# EasyEDA schematic SCH_RE2-YMF262-REV.0.5_2024-09-21.json

## Sheets
1 OPL3: TITLE: Sheet_1; REV: 1.0; Date: 2024-01-10; Sheet: 1/1; Drawn By: Denjhang; Company: Your Company
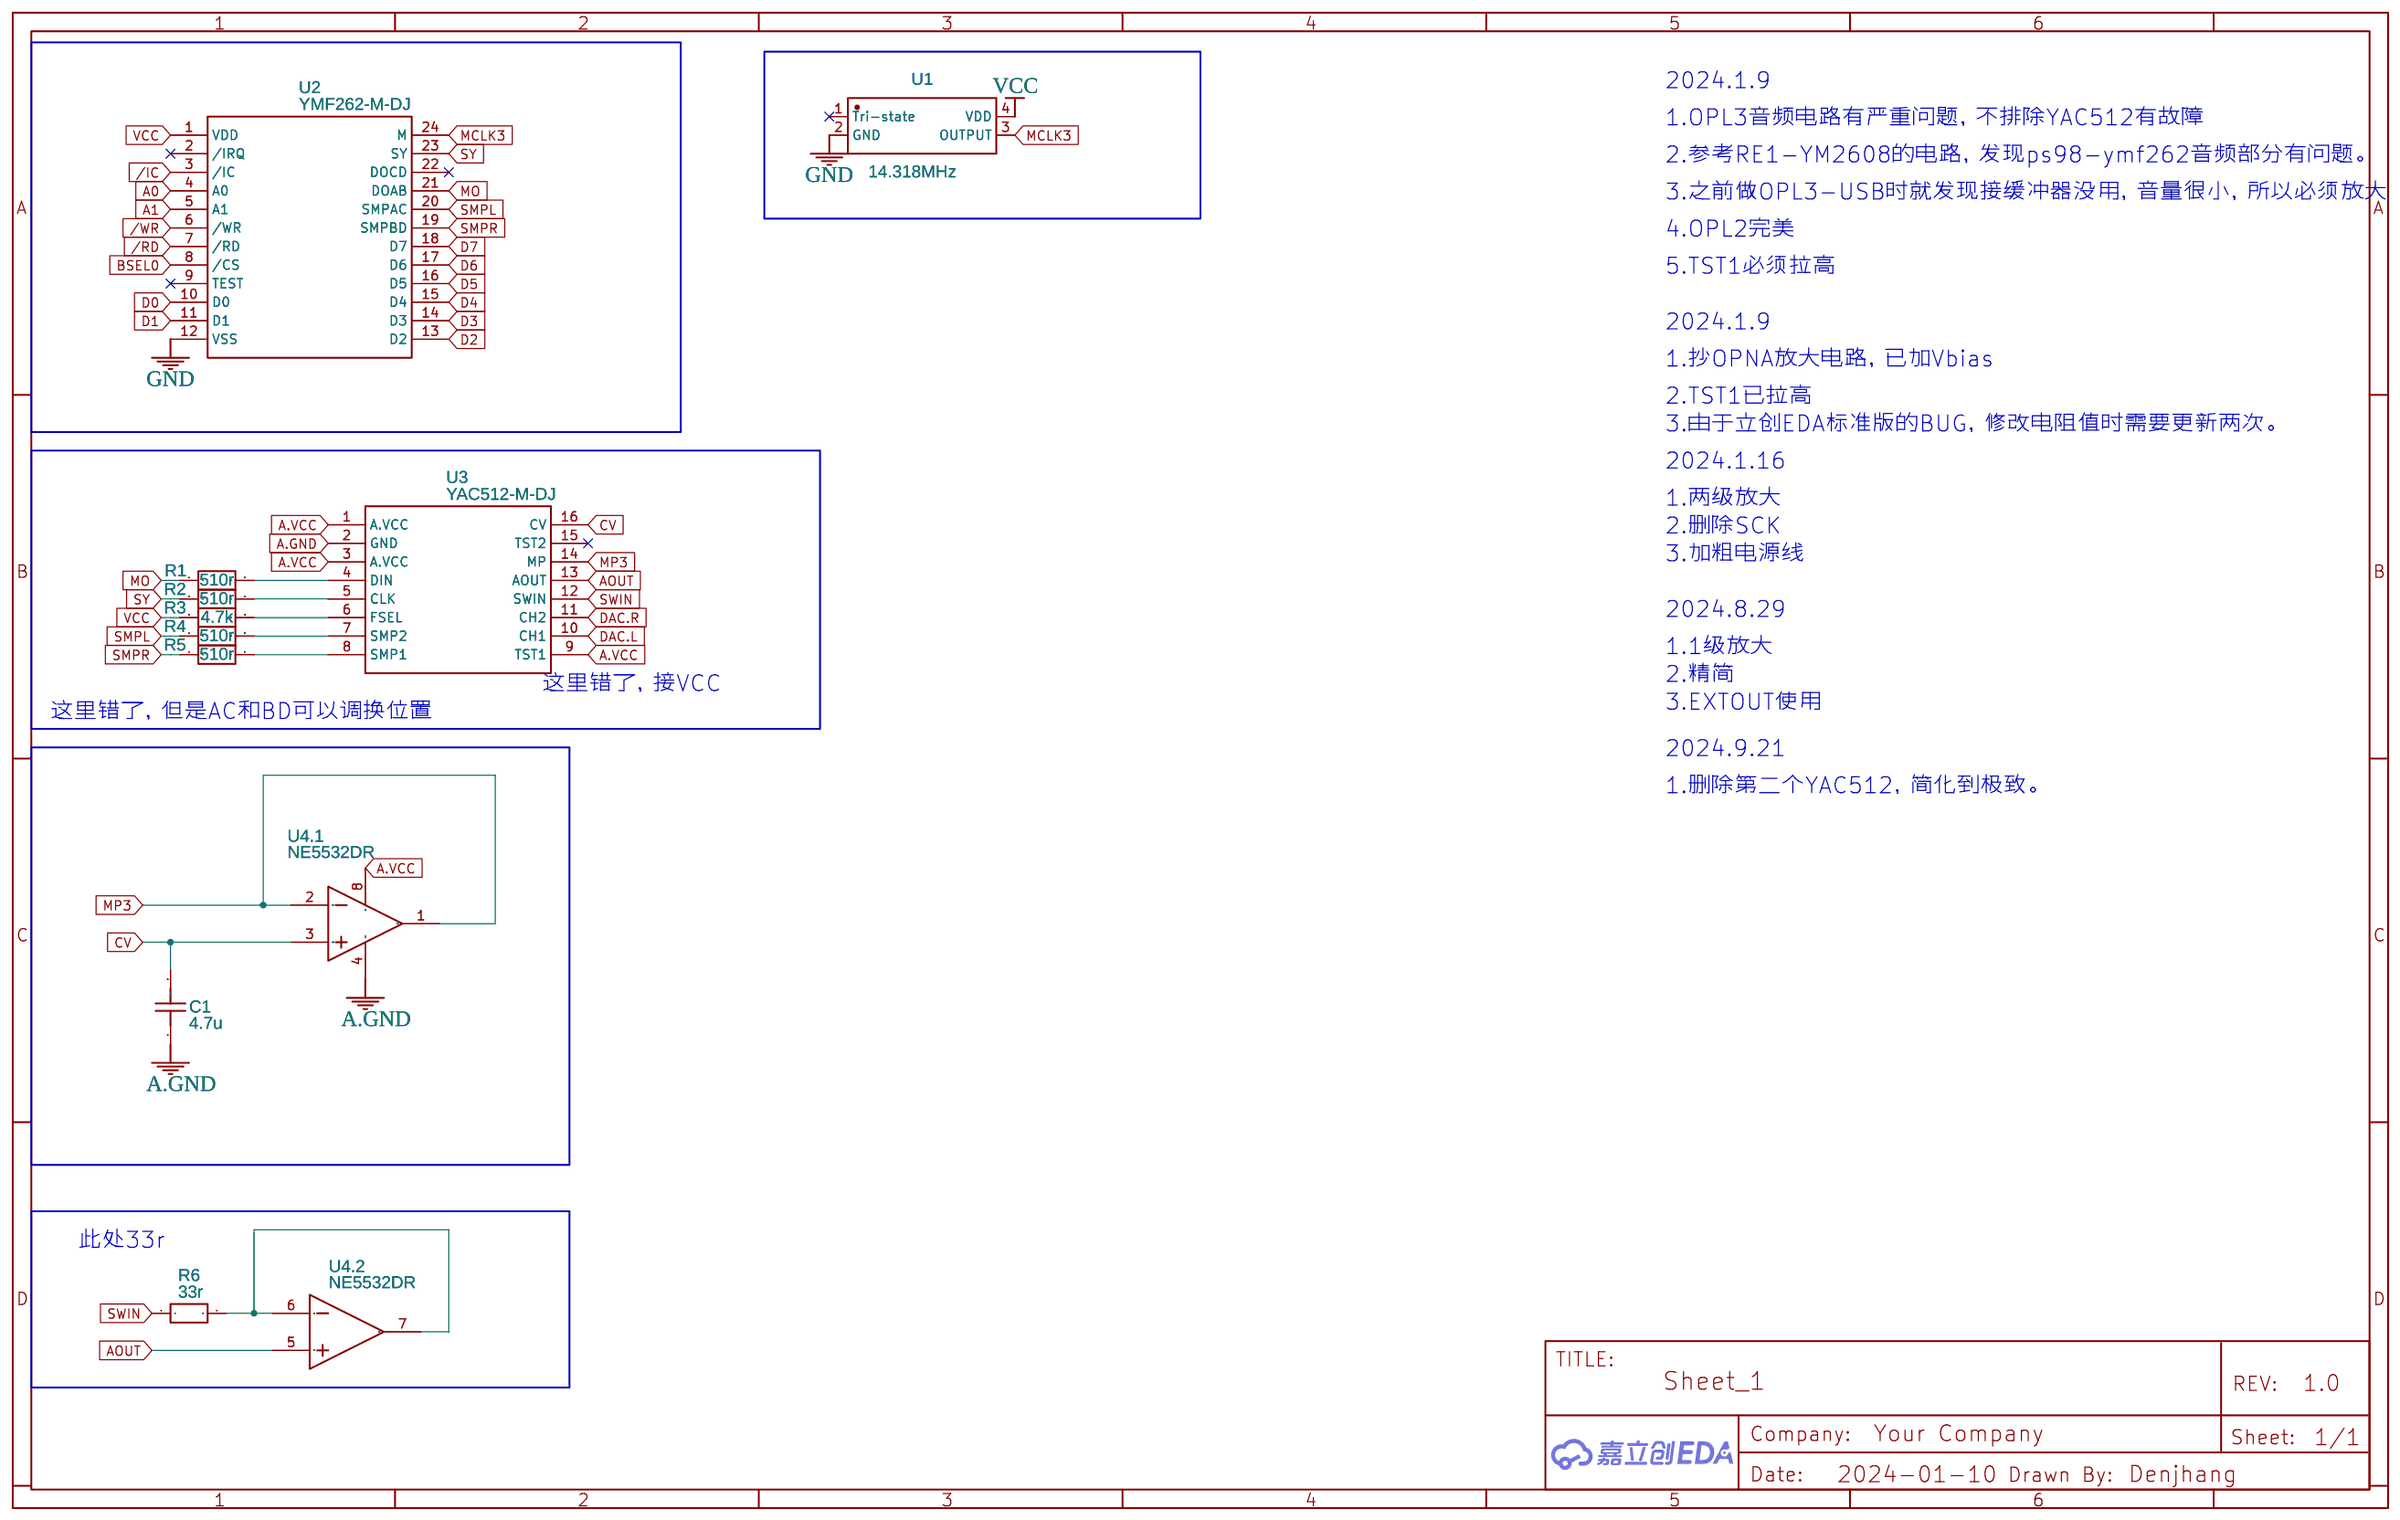
[diagram p0: OPL3]
2 BUS
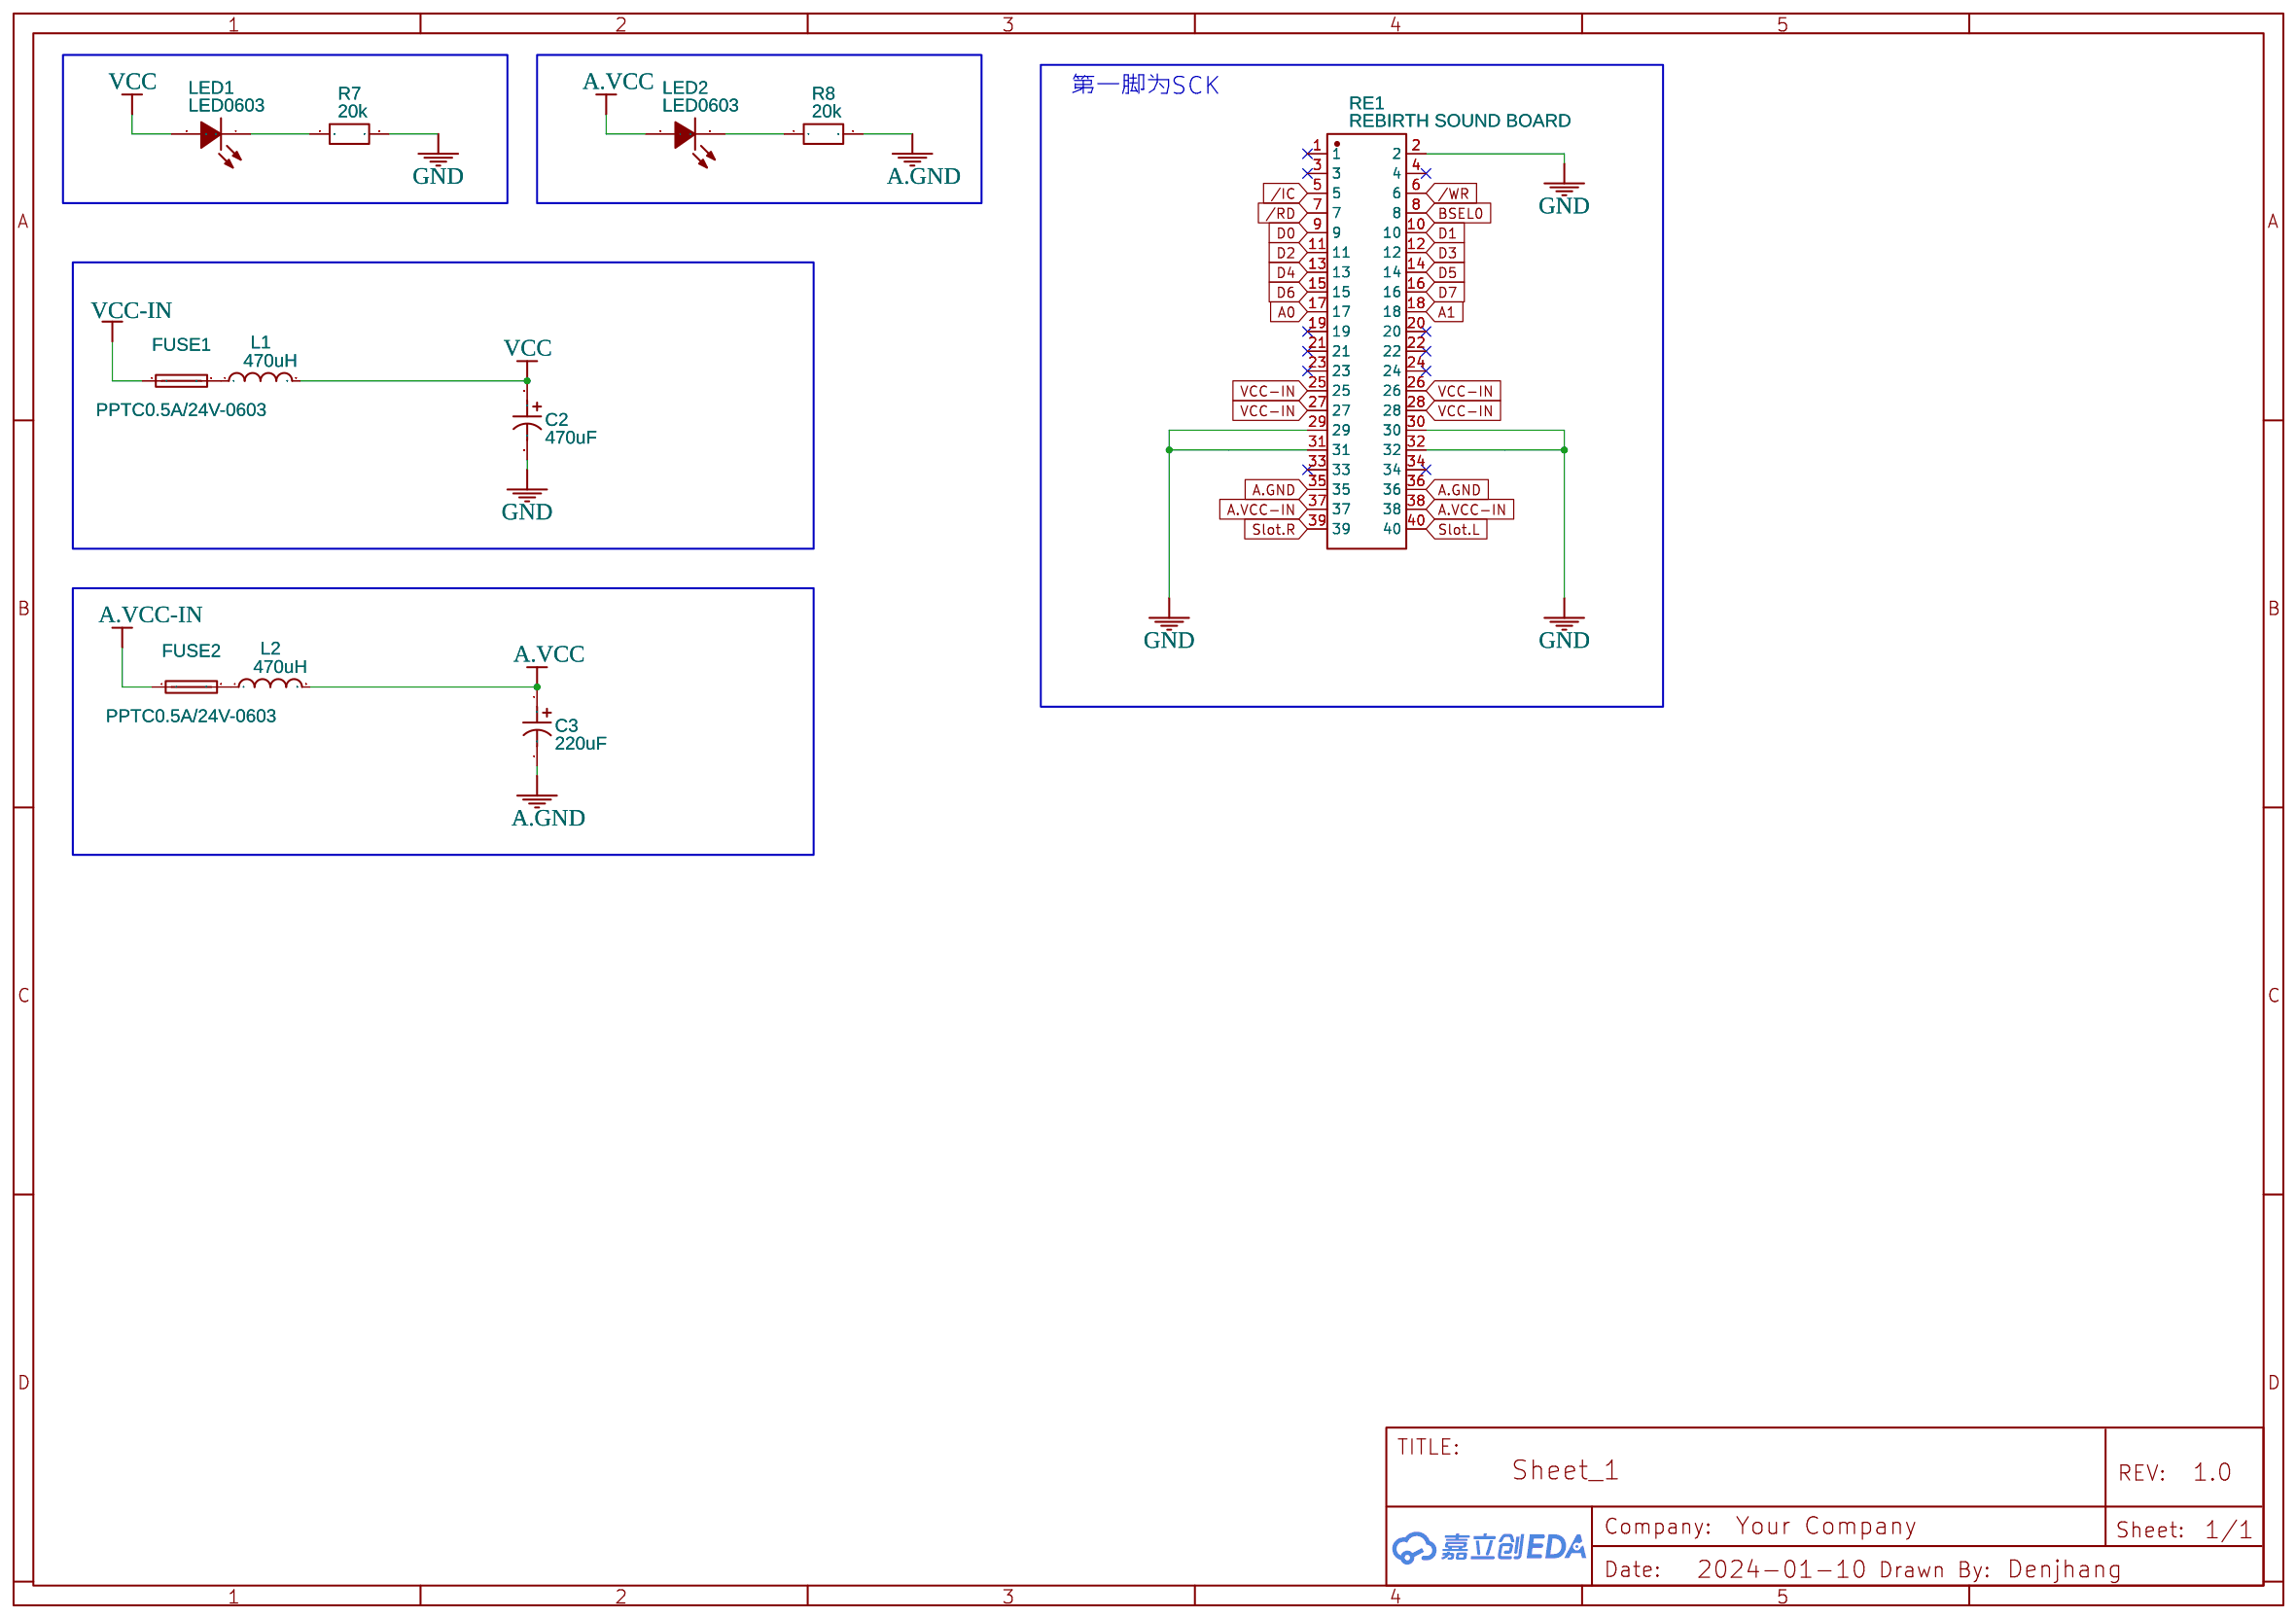
[diagram p1: BUS]
3 AMP2: Date: 2024-01-16
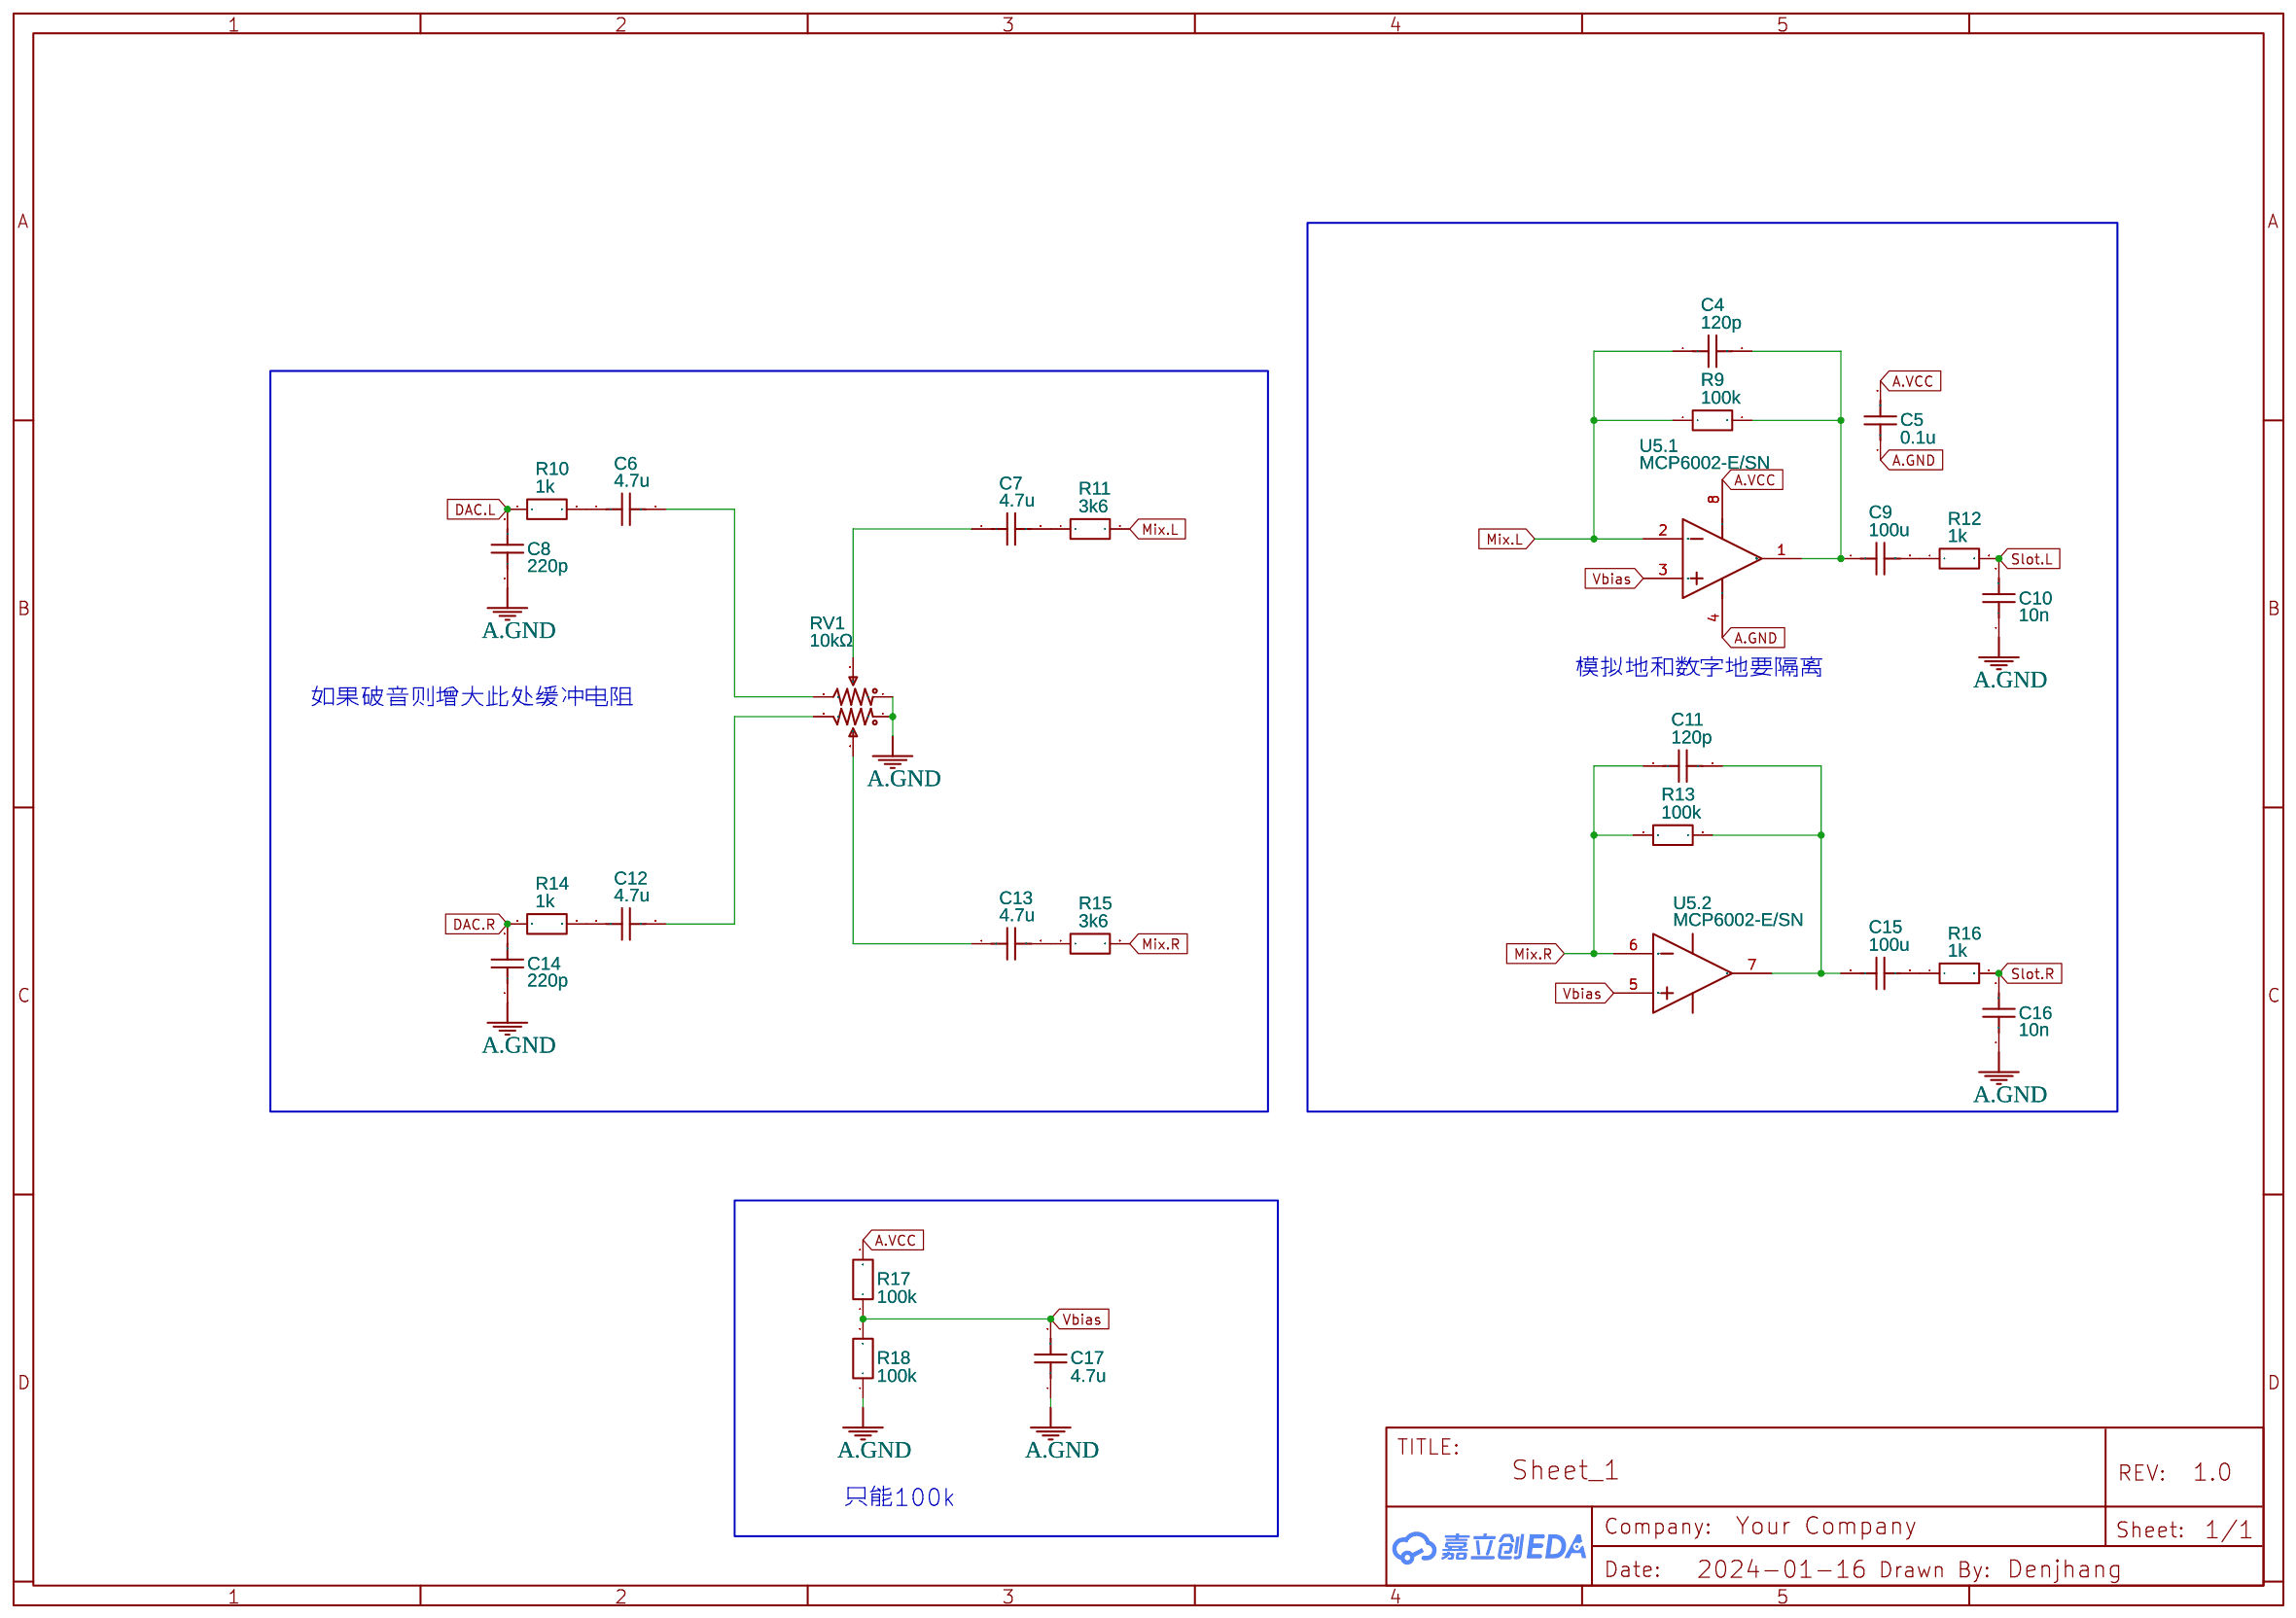
[diagram p2: AMP2]

## Parts
sheet AMP2
C4  120p  [C0603]
C5  0.1u  [C0603]
C6  4.7u  [C0603]
C7  4.7u  [C0603]
C8  220p  [C0603]
C9  100u  [C1206]
C10  10n  [C0603]
C11  120p  [C0603]
C12  4.7u  [C0603]
C13  4.7u  [C0603]
C14  220p  [C0603]
C15  100u  [C1206]
C16  10n  [C0603]
C17  4.7u  [C0603]
R9  100k  [R0603]
R10  1k  [R0603]
R11  3k6  [R0603]
R12  1k  [R0603]
R13  100k  [R0603]
R14  1k  [R0603]
R15  3k6  [R0603]
R16  1k  [R0603]
R17  100k  [R0603]
R18  100k  [R0603]
RV1  10kΩ  [RK097G-DJ]
U5  MCP6002-E/SN  [SOIC-8_L5.0-W4.0-P1.27-LS6.0-BL]  (sections 1,2)
sheet BUS
C2  470uF  [CAP-SMD_BD6.3-L6.6-W6.6-FD]
C3  220uF  [CAP-SMD_BD6.3-L6.6-W6.6-LS7.2-FD]
FUSE1  PPTC0.5A/24V-0603  [F0603]
FUSE2  PPTC0.5A/24V-0603  [F0603]
L1  470uH  [IND-SMD_L5.8-W5.2]
L2  470uH  [IND-SMD_L5.8-W5.2]
LED1  LED0603  [LED0603-RD]
LED2  LED0603  [LED0603-RD]
R7  20k  [R0603]
R8  20k  [R0603]
RE1  REBIRTH SOUND BOARD  [REBIRTH SOUND BOARD]
sheet OPL3
C1  4.7u  [C0603]
R1  510r  [R0603]
R2  510r  [R0603]
R3  4.7k  [R0603]
R4  510r  [R0603]
R5  510r  [R0603]
R6  33r  [R0603]
U1  14.318MHz  [OSC-SMD_4P-L3.2-W2.5-BL]
U2  YMF262-M-DJ  [SOIC24-YMF276]
U3  YAC512-M-DJ  [YAC512-M-DJ]
U4  NE5532DR  [SOIC-8_L4.9-W3.9-P1.27-LS6.0-BL]  (sections 1,2)

## Library data of the parts
C1 C4-C8 C10-C14 C16 C17 = C_0603_US: Contributor: LCEDA_Lib
C9 C15 = C_1206_US: Contributor: LCEDA_Lib
R1-R18 = R_0603_EU: Contributor: LCEDA_Lib
RV1 = RK097-双连体: Contributor: LCSC; Supplier: LCSC; Supplier Part: C231763; Manufacturer: ALPSALPINE(阿尔卑斯阿尔派); Manufacturer Part: RK09712200MY; JLCPCB Part Class: Extended Part
U5 = MCP6002-E/SN: subpart_no: 1; Supplier: LCSC; Supplier Part: C636235; Manufacturer: MICROCHIP(美国微芯); JLCPCB Part Class: Extended Part
C2 = RVT220UF16V67RV0015: Contributor: LCSC; Supplier: LCSC; Supplier Part: C2887273; Manufacturer: KNSCHA(科尼盛); JLCPCB Part Class: Extended Part; link: https://so.szlcsc.com/global.html?k=C2887273&ref=editor
C3 = RVT47UF35V67RV0039: Contributor: LCSC; Supplier: LCSC; Supplier Part: C2836440; Manufacturer: KNSCHA(科尼盛); JLCPCB Part Class: Extended Part; link: https://so.szlcsc.com/global.html?k=C2836440&ref=editor
FUSE1 FUSE2 = PPTC0.5A/24V-0603: Contributor: LCSC; Supplier: LCSC; Supplier Part: C9900007586; Manufacturer: null; Manufacturer Part: PPTC0.5A/24V 自恢复保险丝-0603; JLCPCB Part Class: Extended Part
L1 L2 = MSCD54-471KT: Contributor: LCSC; Supplier: LCSC; Supplier Part: C915206; Manufacturer: Meled(美莱); JLCPCB Part Class: Extended Part; link: https://so.szlcsc.com/global.html?k=C915206&ref=editor
LED1 LED2 = LED0603: Supplier: LCSC; Supplier Part: C2892154; Manufacturer: GBG; Manufacturer Part: GBG-C192KRKT; link: https://atta.szlcsc.comnull; Contributor: Denjhang
RE1 = REBIRTH SOUND BOARD: Contributor: lcsc; Supplier: LCSC; Supplier Part: C5242133; Manufacturer: XKB Connectivity(中国星坤); Manufacturer Part: X6522WR-2x20H-C60D30-E43F03
U1 = OT32254MJBA4SL: Contributor: lcsc; Supplier: LCSC; Supplier Part: C2831397; Manufacturer: YXC(扬兴晶振); JLCPCB Part Class: Extended Part; link: https://so.szlcsc.com/global.html?k=C2831397&ref=editor
U2 = YMF262-M-DJ: Contributor: denjhang
U3 = YAC512-M-DJ: Contributor: denjhang
U4 = NE5532DR: image: //image.lceda.cn/szlcsc/C7426.jpg; SMT Type: Basic; subpart_no: 2; Supplier: LCSC; Manufacturer: TI(德州仪器); LCSC Assembly: Yes; Supplier Part: C7426; JLCPCB Part Class: Basic Part

## Nets
GND: C2.2 R7.2 RE1.2 RE1.29 RE1.30 RE1.31 RE1.32 U1.2(GND) U2.12(VSS)
VCC: C2.1 L1.2 LED1.2(A) R3.1 U1.4(VDD) U2.1(VDD)
VCC-IN: FUSE1.1 RE1.25 RE1.26 RE1.27 RE1.28
/IC: RE1.5 U2.3(/IC)
/RD: RE1.7 U2.7(/RD)
/WR: RE1.6 U2.6(/WR)
A0: RE1.17 U2.4(A0)
A1: RE1.18 U2.5(A1)
A.GND: C1.1 C3.2 C5.1 C8.1 C10.1 C14.1 C16.1 C17.1 R8.2 R18.1 RE1.35 RE1.36 RV1.1 RV1.4 U3.2(GND) U4.4(VCC-/GND) U5.4(VSS)
A.VCC: C3.1 C5.2 L2.2 LED2.2(A) R17.2 U3.1(A.VCC) U3.3(A.VCC) U3.9(TST1) U4.8(VCC+) U5.8(VDD)
A.VCC-IN: FUSE2.1 RE1.37 RE1.38
AOUT: U3.13(AOUT) U4.5(IN2+)
BSEL0: RE1.8 U2.8(/CS)
CV: C1.2 U3.16(CV) U4.3(IN1+)
D0: RE1.9 U2.10(D0)
D1: RE1.10 U2.11(D1)
D2: RE1.11 U2.13(D2)
D3: RE1.12 U2.14(D3)
D4: RE1.13 U2.15(D4)
D5: RE1.14 U2.16(D5)
D6: RE1.15 U2.17(D6)
D7: RE1.16 U2.18(D7)
DAC.L: C8.2 R10.1 U3.10(CH1)
DAC.R: C14.2 R14.1 U3.11(CH2)
MCLK3: U1.3(OUTPUT) U2.24(M)
Mix.L: C4.1 R9.1 R11.2 U5.2(VINA-)
Mix.R: C11.1 R13.1 R15.2 U5.6(VINB-)
MO: R1.1 U2.21(DOAB)
MP3: U3.14(MP) U4.1(OUT1) U4.2(IN1-)
Slot.L: C10.2 R12.2 RE1.40
Slot.R: C16.2 R16.2 RE1.39
SMPL: R4.1 U2.20(SMPAC)
SMPR: R5.1 U2.19(SMPBD)
SWIN: R6.1 U3.12(SWIN)
SY: R2.1 U2.23(SY)
Vbias: C17.2 R17.1 R18.2 U5.3(VINA+) U5.5(VINB+)
Net-(C4-2): C4.2 C9.1 R9.2 U5.1(VOUTA)
Net-(C6-1): C6.1 R10.2
Net-(C6-2): C6.2 RV1.3
Net-(C7-1): C7.1 RV1.2
Net-(C7-2): C7.2 R11.1
Net-(C9-2): C9.2 R12.1
Net-(C11-2): C11.2 C15.1 R13.2 U5.7(VOUTB)
Net-(C12-1): C12.1 R14.2
Net-(C12-2): C12.2 RV1.6
Net-(C13-1): C13.1 RV1.5
Net-(C13-2): C13.2 R15.1
Net-(C15-2): C15.2 R16.1
Net-(FUSE1-2): FUSE1.2 L1.1
Net-(FUSE2-2): FUSE2.2 L2.1
Net-(LED1-1): LED1.1(C) R7.1
Net-(LED2-1): LED2.1(C) R8.1
Net-(R1-2): R1.2 U3.4(DIN)
Net-(R2-2): R2.2 U3.5(CLK)
Net-(R3-2): R3.2 U3.6(FSEL)
Net-(R4-2): R4.2 U3.7(SMP2)
Net-(R5-2): R5.2 U3.8(SMP1)
Net-(R6-2): R6.2 U4.6(IN2-) U4.7(OUT2)

Not connected (* = marked no-connect by the designer): RE1 1* 3* 4* 19* 20* 21* 22* 23* 24* 33* 34*; U1 1(Tri-state)*; U2 2(/IRQ)* 9(TEST)* 22(DOCD)*; U3 15(TST2)*

## Notes on the sheets
sheet 1
- 2024.1.9
- 1.OPL3音频电路有严重问题，不排除YAC512有故障
- 2.参考RE1-YM2608的电路，发现ps98-ymf262音频部分有问题。
- 3.之前做OPL3-USB时就发现接缓冲器没用，音量很小，所以必须放大
- 4.OPL2完美
- 5.TST1必须拉高
- 2024.1.9
- 1.抄OPNA放大电路，已加Vbias
- 2.TST1已拉高
- 3.由于立创EDA标准版的BUG，修改电阻值时需要更新两次。
- 2024.1.16
- 1.两级放大
- 2.删除SCK
- 3.加粗电源线
- 2024.8.29
- 1.1级放大
- 这里错了，接VCC
- 2.精简
- 这里错了，但是AC和BD可以调换位置
- 3.EXTOUT使用
- 2024.9.21
- 1.删除第二个YAC512，简化到极致。
- 此处33r
sheet 2
- 第一脚为SCK
sheet 3
- 模拟地和数字地要隔离
- 如果破音则增大此处缓冲电阻
- 只能100k
